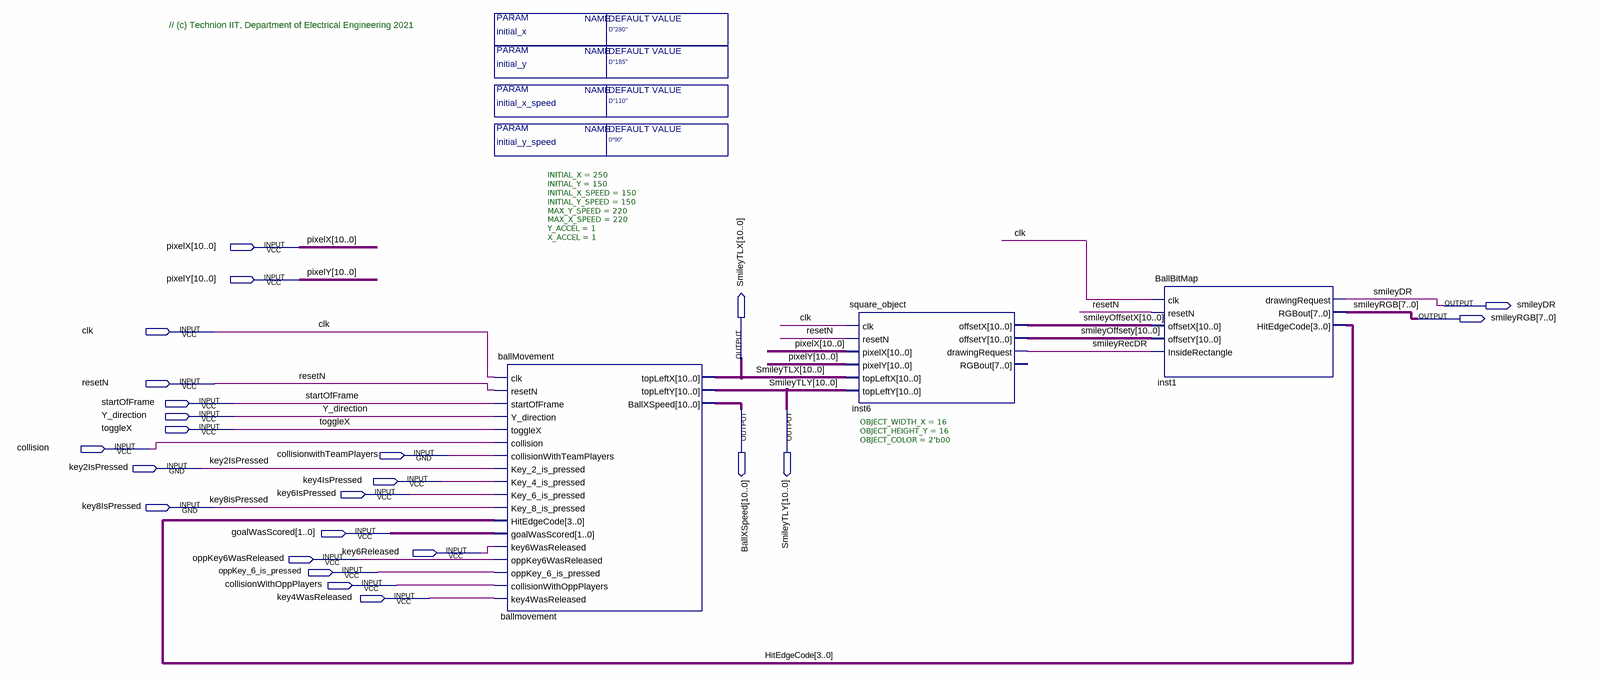
[diagram p0: schematic sheet]
// Quartus schematic Ball_Block.bdf as structural Verilog: 3 symbols, 24 pins
module Ball_Block #(parameter initial_x = "D\"280\"", parameter initial_y = "D\"185\"", parameter initial_x_speed = "D\"110\"", parameter initial_y_speed = "D\"90\"") (
  input  [10:0] pixelX,
  input  [10:0] pixelY,
  input  clk,
  input  resetN,
  input  startOfFrame,
  input  Y_direction,
  input  toggleX,
  input  collision,
  input  collisionwithTeamPlayers,
  input  key2IsPressed,
  input  key4IsPressed,
  input  key6IsPressed,
  input  key8IsPressed,
  input  [1:0] goalWasScored,
  input  key6Released,
  input  oppKey6WasReleased,
  input  oppKey_6_is_pressed,
  input  collisionWithOppPlayers,
  input  key4WasReleased,
  output smileyDR,
  output [7:0] smileyRGB,
  output [10:0] SmileyTLX,
  output [10:0] BallXSpeed,
  output [10:0] SmileyTLY
);

  wire smileyRecDR;
  wire [3:0] HitEdgeCode;
  wire [10:0] smileyOffsetX, smileyOffsety;

  ballMovement #(.INITIAL_X(250), .INITIAL_Y(150), .INITIAL_X_SPEED(150), .INITIAL_Y_SPEED(150), .MAX_Y_SPEED(220), .MAX_X_SPEED(220), .Y_ACCEL(1), .X_ACCEL(1)) ballmovement (
    .clk(clk), .resetN(resetN), .startOfFrame(startOfFrame), .Y_direction(Y_direction), .toggleX(toggleX),
    .collision(collision), .collisionWithTeamPlayers(collisionwithTeamPlayers),
    .Key_2_is_pressed(key2IsPressed), .Key_4_is_pressed(key4IsPressed), .Key_6_is_pressed(key6IsPressed),
    .Key_8_is_pressed(key8IsPressed), .HitEdgeCode(HitEdgeCode), .goalWasScored(goalWasScored),
    .key6WasReleased(key6Released), .oppKey6WasReleased(oppKey6WasReleased),
    .oppKey_6_is_pressed(oppKey_6_is_pressed), .collisionWithOppPlayers(collisionWithOppPlayers),
    .key4WasReleased(key4WasReleased), .topLeftX(SmileyTLX), .topLeftY(SmileyTLY), .BallXSpeed(BallXSpeed));
  square_object #(.OBJECT_WIDTH_X(16), .OBJECT_HEIGHT_Y(16), .OBJECT_COLOR(2'b00)) inst6 (
    .clk(clk), .resetN(resetN), .pixelX(pixelX), .pixelY(pixelY), .topLeftX(SmileyTLX), .topLeftY(SmileyTLY),
    .offsetX(smileyOffsetX), .offsetY(smileyOffsety), .drawingRequest(smileyRecDR));  // open: RGBout
  BallBitMap inst1 (
    .clk(clk), .resetN(resetN), .offsetX(smileyOffsetX), .offsetY(smileyOffsety),
    .InsideRectangle(smileyRecDR), .drawingRequest(smileyDR), .RGBout(smileyRGB), .HitEdgeCode(HitEdgeCode));

  // Notes on the sheet:
  //   // (c) Technion IIT, Department of Electrical Engineering 2021
endmodule
